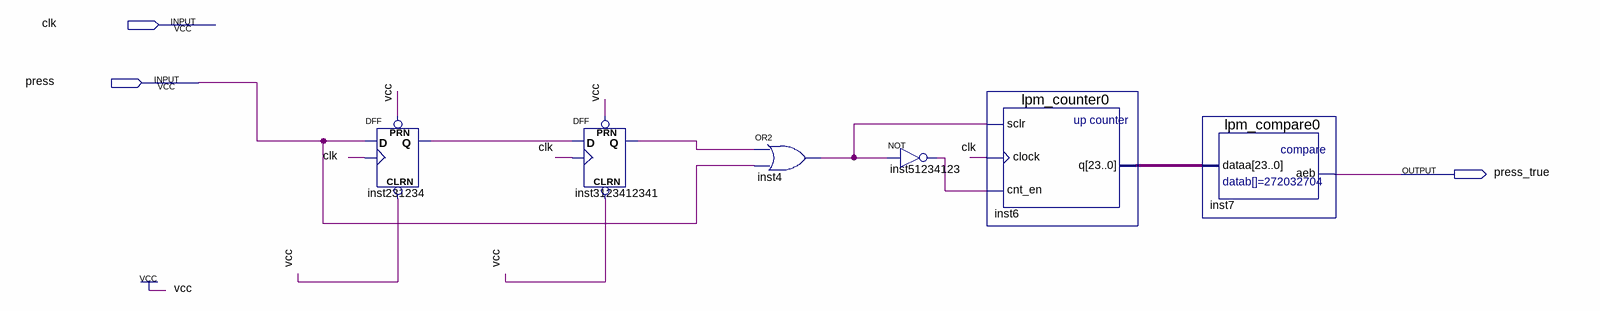
[diagram p0: schematic sheet]
// Quartus schematic clock_filter.bdf as structural Verilog: 6 symbols, 3 pins
module clock_filter (
  input  clk,
  input  press,
  output press_true
);

  wire inst4_out, inst231234_q, inst51234123_out, inst3123412341_q;
  wire [23:0] inst6_q;

  DFF inst231234 (.CLRN(1'b1), .CLK(clk), .D(press), .PRN(1'b1), .Q(inst231234_q));
  DFF inst3123412341 (.CLRN(1'b1), .CLK(clk), .D(inst231234_q), .PRN(1'b1), .Q(inst3123412341_q));
  or inst4 (inst4_out, inst3123412341_q, press);
  not inst51234123 (inst51234123_out, inst4_out);
  lpm_counter0 inst6 (.sclr(inst4_out), .clock(clk), .cnt_en(inst51234123_out), .q(inst6_q));
  lpm_compare0 inst7 (.dataa(inst6_q), .aeb(press_true));
endmodule
